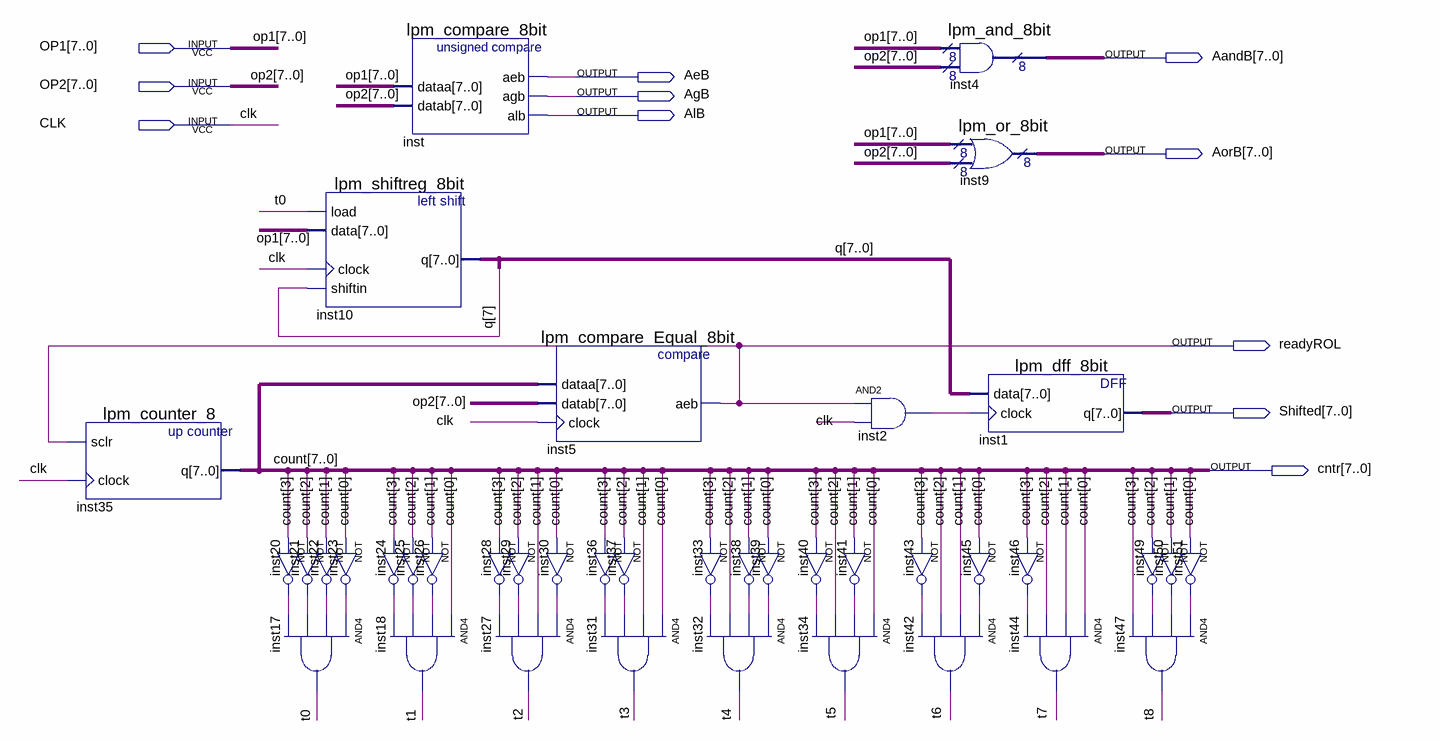
[diagram p0: schematic sheet]
// Quartus schematic ALU.bdf as structural Verilog: 40 symbols, 11 pins
module ALU (
  input  [7:0] OP1,
  input  [7:0] OP2,
  input  CLK,
  output [7:0] AandB,
  output AeB,
  output AgB,
  output AlB,
  output [7:0] AorB,
  output readyROL,
  output [7:0] Shifted,
  output [7:0] cntr
);

  wire inst2_out, inst20_out, inst21_out, inst22_out, inst23_out, inst24_out, inst25_out, inst26_out,
       inst28_out, inst29_out, inst30_out, inst33_out, inst36_out, inst37_out, inst38_out, inst39_out,
       inst40_out, inst41_out, inst43_out, inst45_out, inst46_out, inst49_out, inst50_out, inst51_out, t0,
       t1, t2, t3, t4, t5, t6, t7, t8;
  wire [7:0] q;

  lpm_counter_8 inst35 (.sclr(readyROL), .clock(CLK), .q(cntr));
  not inst20 (inst20_out, cntr[3]);
  and inst17 (t0, inst23_out, inst22_out, inst21_out, inst20_out);
  lpm_shiftreg_8bit inst10 (.load(t0), .data(OP1), .clock(CLK), .shiftin(q[7]), .q(q));
  not inst21 (inst21_out, cntr[2]);
  not inst22 (inst22_out, cntr[1]);
  not inst23 (inst23_out, cntr[0]);
  lpm_compare_8bit inst (.dataa(OP1), .datab(OP2), .aeb(AeB), .agb(AgB), .alb(AlB));
  not inst24 (inst24_out, cntr[3]);
  not inst25 (inst25_out, cntr[2]);
  not inst26 (inst26_out, cntr[1]);
  and inst18 (t1, cntr[0], inst26_out, inst25_out, inst24_out);
  not inst28 (inst28_out, cntr[3]);
  not inst29 (inst29_out, cntr[2]);
  and inst27 (t2, inst30_out, cntr[1], inst29_out, inst28_out);
  lpm_compare_Equal_8bit inst5 (.dataa(cntr), .datab(OP2), .clock(CLK), .aeb(readyROL));
  not inst30 (inst30_out, cntr[0]);
  not inst36 (inst36_out, cntr[3]);
  and inst31 (t3, cntr[0], cntr[1], inst37_out, inst36_out);
  not inst37 (inst37_out, cntr[2]);
  not inst33 (inst33_out, cntr[3]);
  not inst38 (inst38_out, cntr[1]);
  and inst32 (t4, inst39_out, inst38_out, cntr[2], inst33_out);
  not inst39 (inst39_out, cntr[0]);
  not inst40 (inst40_out, cntr[3]);
  and inst34 (t5, cntr[0], inst41_out, cntr[2], inst40_out);
  and inst2 (inst2_out, readyROL, CLK);
  not inst41 (inst41_out, cntr[1]);
  lpm_and_8bit inst4 (.data0x(OP1), .data1x(OP2), .result(AandB));
  lpm_or_8bit inst9 (.data0x(OP1), .data1x(OP2), .result(AorB));
  lpm_dff_8bit inst1 (.data(q), .clock(inst2_out), .q(Shifted));
  not inst43 (inst43_out, cntr[3]);
  not inst45 (inst45_out, cntr[0]);
  and inst42 (t6, inst45_out, cntr[1], cntr[2], inst43_out);
  not inst46 (inst46_out, cntr[3]);
  and inst44 (t7, cntr[0], cntr[1], cntr[2], inst46_out);
  and inst47 (t8, inst51_out, inst50_out, inst49_out, cntr[3]);
  not inst49 (inst49_out, cntr[2]);
  not inst50 (inst50_out, cntr[1]);
  not inst51 (inst51_out, cntr[0]);

  // Other names for the same wires on the sheet: count[7:0] = cntr
endmodule
